# EAGLE design power_indicator_left (EAGLE 7.3.0)
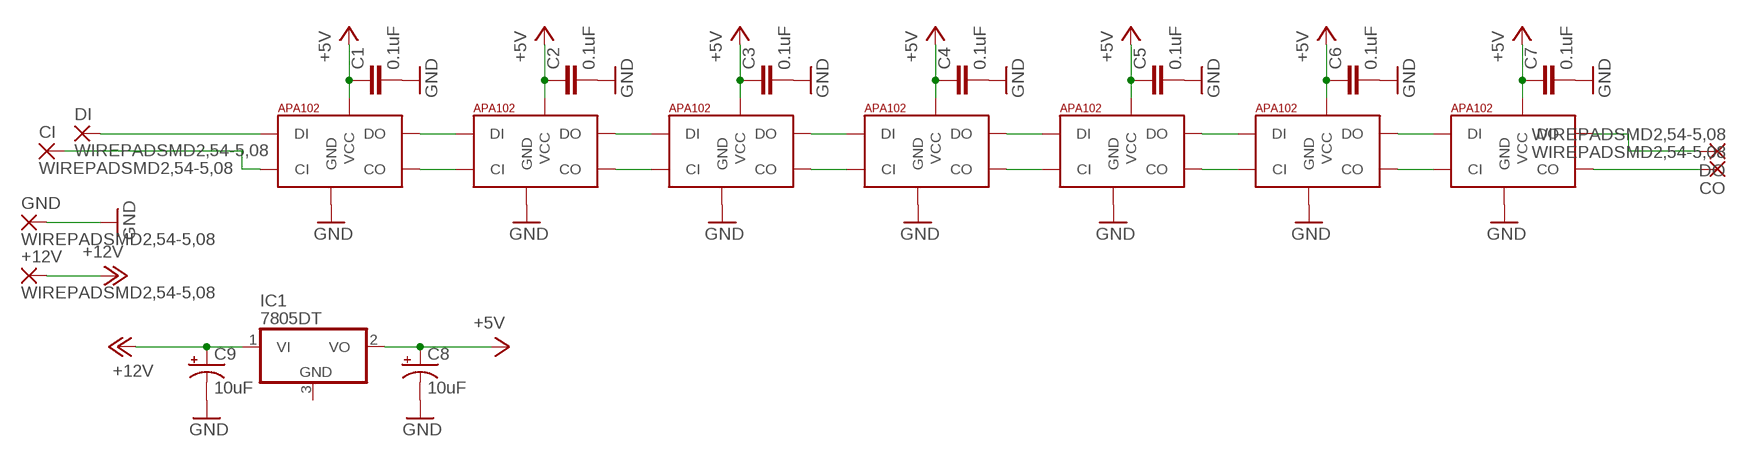
[diagram p0: schematic, sheet 1]

## Parts
+12V  WIREPADSMD2,54-5,08  [SMD2,54-5,08]
C1  0.1uF  0.1UF-100V-10%(0603)  [0603-CAP]
C2  0.1uF  0.1UF-100V-10%(0603)  [0603-CAP]
C3  0.1uF  0.1UF-100V-10%(0603)  [0603-CAP]
C4  0.1uF  0.1UF-100V-10%(0603)  [0603-CAP]
C5  0.1uF  0.1UF-100V-10%(0603)  [0603-CAP]
C6  0.1uF  0.1UF-100V-10%(0603)  [0603-CAP]
C7  0.1uF  0.1UF-100V-10%(0603)  [0603-CAP]
C8  10uF  10UF-TANT  [EIA3216]
C9  10uF  10UF-TANT  [EIA3216]
CI  WIREPADSMD2,54-5,08  [SMD2,54-5,08]
CO  WIREPADSMD2,54-5,08  [SMD2,54-5,08]
DI  WIREPADSMD2,54-5,08  [SMD2,54-5,08]
DO  WIREPADSMD2,54-5,08  [SMD2,54-5,08]
GND  WIREPADSMD2,54-5,08  [SMD2,54-5,08]
IC1  7805DT  [TO252]
U$1  APA1025050  [APA102_5050]
U$2  APA1025050  [APA102_5050]
U$3  APA1025050  [APA102_5050]
U$4  APA1025050  [APA102_5050]
U$5  APA1025050  [APA102_5050]
U$6  APA1025050  [APA102_5050]
U$7  APA1025050  [APA102_5050]

## Nets
+5V: C1.1 C2.1 C3.1 C4.1 C5.1 C6.1 C7.1 C8.A(+) IC1.2(VO) U$1.1(VCC) U$2.1(VCC) U$3.1(VCC) U$4.1(VCC) U$5.1(VCC) U$6.1(VCC) U$7.1(VCC)
+12V: +12V.1(P) C9.A(+) IC1.1(VI)
GND: C1.2 C2.2 C3.2 C4.2 C5.2 C6.2 C7.2 C8.C(-) C9.C(-) GND.1(P) U$1.6(GND) U$2.6(GND) U$3.6(GND) U$4.6(GND) U$5.6(GND) U$6.6(GND) U$7.6(GND)
N$1: U$1.2(CO) U$2.5(CI)
N$2: U$1.3(DO) U$2.4(DI)
N$3: U$2.2(CO) U$3.5(CI)
N$4: U$2.3(DO) U$3.4(DI)
N$5: U$3.2(CO) U$4.5(CI)
N$6: U$3.3(DO) U$4.4(DI)
N$7: U$4.2(CO) U$5.5(CI)
N$8: U$4.3(DO) U$5.4(DI)
N$9: U$5.2(CO) U$6.5(CI)
N$10: U$5.3(DO) U$6.4(DI)
N$11: U$6.2(CO) U$7.5(CI)
N$12: U$6.3(DO) U$7.4(DI)
N$13: CO.1(P) U$7.2(CO)
N$14: DO.1(P) U$7.3(DO)
N$15: DI.1(P) U$1.4(DI)
N$16: CI.1(P) U$1.5(CI)
Unconnected: IC1.3(GND)

## Library data of the parts
+12V CI CO DI DO GND = wirepad:WIREPAD: Wire PAD connect wire on PCB
C1-C7 = SparkFun-Capacitors:0.1UF-100V-10%(0603): CAP-08390; PROD_ID: CAP-08390
C8 C9 = SparkFun-Retired:10UF-TANT: 10uF Tantalum SMT CAP-00811- 16V 10% (EIA-3216); PROD_ID: CAP-00811
IC1 = linear:78*: Positive VOLTAGE REGULATOR Source: http://cache.national.com/ds/LM/LM78L05.pdf http://www.fairchildsemi.com/ds/LM/LM7805.pdf
U$1-U$7 = jos-ph:APA102: APA102C 5050 RGB LED -- Adafruit DotStar Single LED Pixel Product Page: https://www.adafruit.com/products/2343 Datasheet: https://cdn-shop.adafruit.com/product-files/2343/APA102C.pdf

## Board
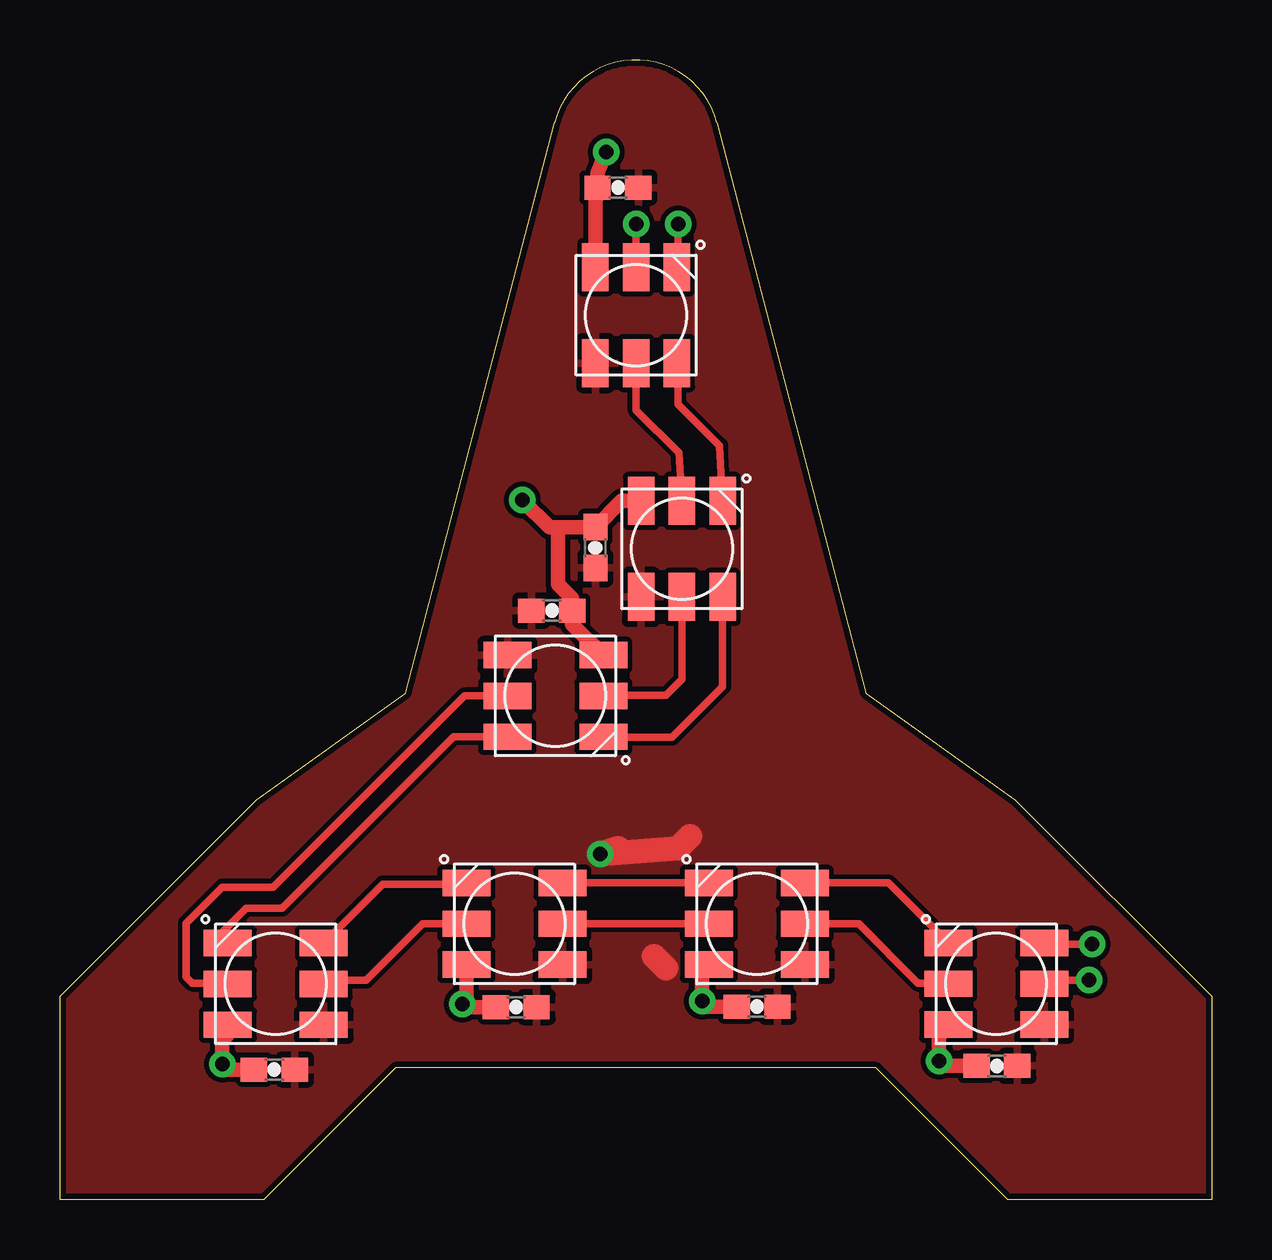
[diagram p1: board, top side]
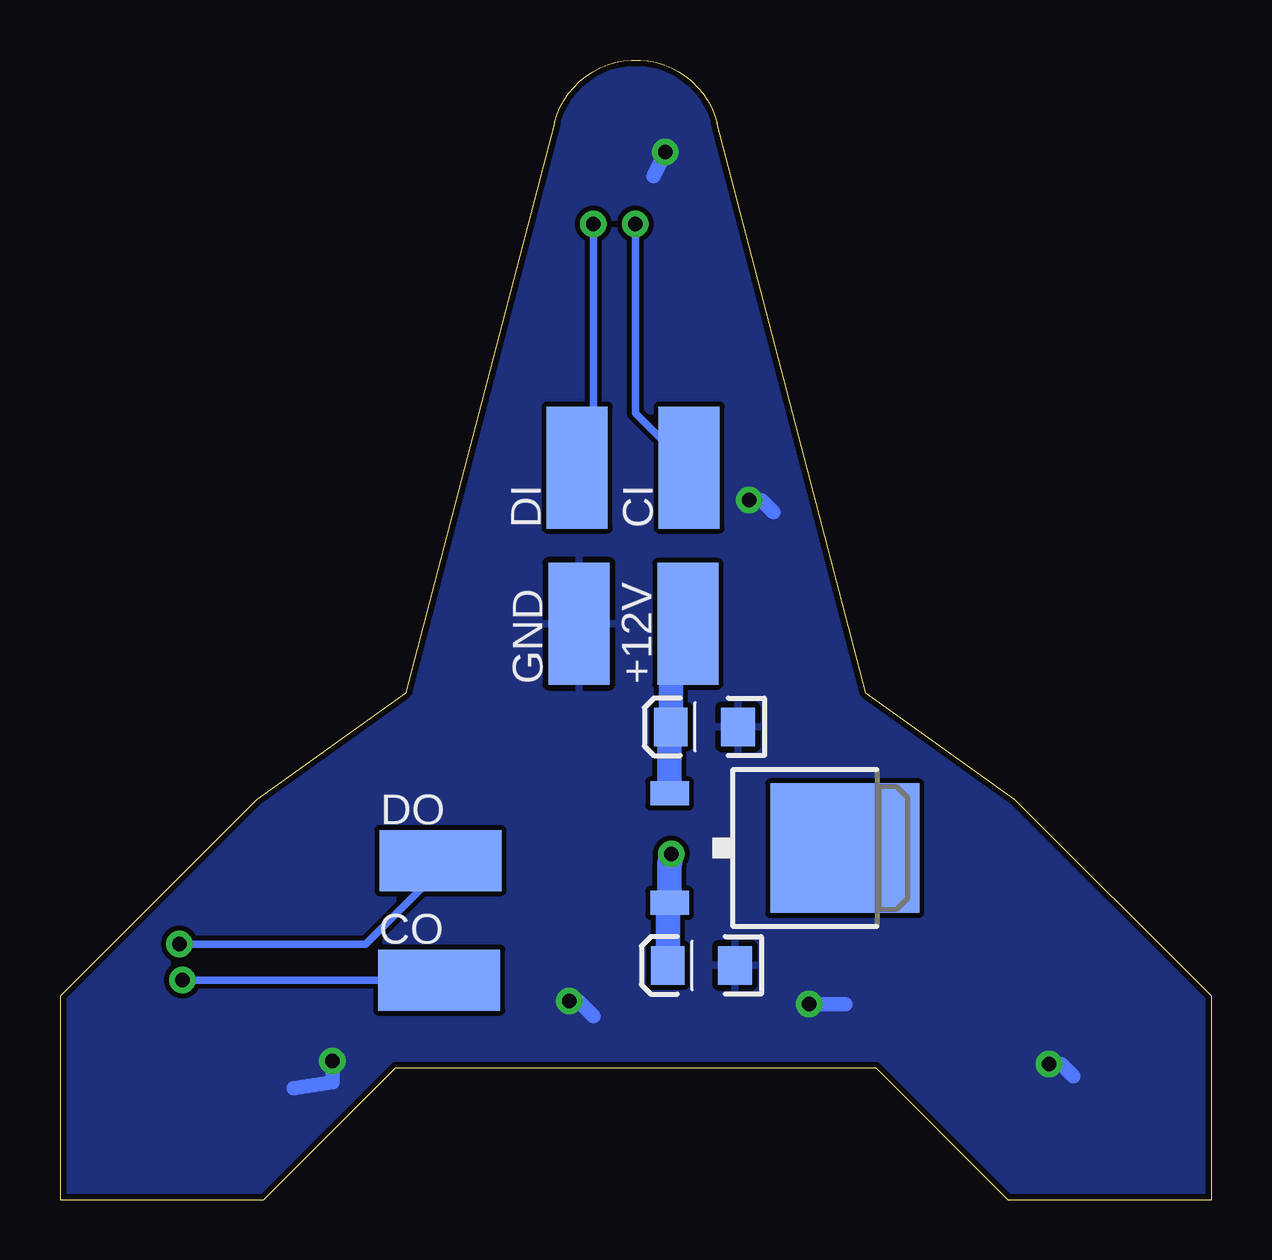
[diagram p2: board, bottom side, seen from below]

Size 48 x 47.5 mm. Coordinates in mm from the lower left corner, seen from the top.
Outline: 34.02,5.5 13.99,5.5 8.49,0 0,0 0,8.48 8.19,16.68 14.4,21.11 20.61,44.88 arc-151 27.39,44.88 33.6,21.11 39.81,16.68 48,8.48 48,0 39.52,0 34.02,5.5
Copper layers (1*16): Top 0.035mm / dielectric 1.5mm / Bottom 0.035mm
Design rules "SparkFun": minimum track width 8mil, minimum drill 20mil, track to track 8mil, track to pad 8mil, pad to pad 8mil, via to via 8mil, smd to smd 8mil, copper to edge 10mil, drill to drill 8mil, minimum pad ring 12mil, minimum via ring 10mil, stop-mask expansion 4mil, vias tented up to drill 25mil, thermal gap 10mil

### Footprints (pad centres in the part's own frame; a part is rotated, then mirrored left to right if it is on the bottom)
SMD2,54-5,08 = smd 2.54 x 5.08: 1 0,0
0603-CAP = smd 1.1 x 1: 1 -0.85,0; 2 0.85,0
EIA3216 = smd 1.4 x 1.6: A 1.4,0; C -1.4,0
TO252 = smd 1 x 1.6: 1 -2.28,-4.8; 2 2.28,-4.8 | smd 5.4 x 6.2: 3 0,2.5
APA102_5050 = smd 2 x 1.1: 1 2,-1.7; 2 2,0; 3 2,1.7; 4 -2,1.7; 5 -2,0; 6 -2,-1.7

### Placement (x,y rotation side)
+12V  21.83,24 0 bottom
C1  23.26,42.18 180 top
C2  22.32,27.18 90 top
C3  20.5,24.55 0 top
C4  8.94,5.43 180 top
C5  19.02,8.04 180 top
C6  29.06,8.05 180 top
C7  39.05,5.58 180 top
C8  21.27,9.77 180 bottom
C9  21.14,19.71 180 bottom
CI  21.78,30.51 0 bottom
CO  32.2,9.16 270 bottom
DI  26.45,30.51 0 bottom
DO  32.14,14.13 270 bottom
GND  26.37,24 0 bottom
IC1  17.79,14.66 270 bottom
U$1  24.02,36.86 270 top
U$2  25.92,27.12 270 top
U$3  20.65,21 180 top
U$4  9,9 0 top
U$5  18.95,11.51 0 top
U$6  29.05,11.51 0 top
U$7  39.02,9.01 0 top

### Tracks (layer width: path | path; a pad name or v marks a point on that pad's centre or on a via)
+5V  (via drill 0.6)
  Top 1.016: 24.77,10.16 25.27,9.66 | 26.27,15.16 25.77,14.66 v22.52,14.41 23.27,14.66
  Bottom 1.016: C8.A 22.67,12.3 IC1.2 22.59,13.98 v22.52,14.41
  pour Top: -1.23,48.66 -1.23,-3.34 49.77,-3.34 49.77,48.66
+12V
  Bottom 1.016: IC1.1 22.59,19.66 C9.A 22.54,23.29 +12V.1
GND  (via drill 0.6)
  Top 0.61: C6.2 27,8.05 v26.77,8.29 26.77,9.66 26.91,9.8 U$6.6 | C7.2 36.6,5.58 v36.64,5.79 36.64,6.8 U$7.6 | U$1.6 22.32,41.59 C1.2 22.41,42.8 v22.77,43.66 | C4.2 7,5.43 v6.77,5.66 6.77,6.66 7,6.89 U$4.6 | C5.2 16.89,8.04 v16.77,8.16 16.95,8.34 U$5.6 | U$3.6 21.35,24 C3.2 21.35,25.07 20.77,25.66 20.77,28.03 | U$2.6 23.41,29.12 C2.2 20.77,28.03 | 20.77,28.03 20.4,28.03 v19.27,29.16
  Bottom 0.61: v26.77,8.29 26.39,8.29 25.77,7.66 | v36.64,5.79 36.64,4.91 38.27,4.66 | v22.77,43.66 23.27,42.66 | v6.77,5.66 6.27,5.66 5.77,5.16 | v16.77,8.16 15.27,8.16 | v19.27,29.16 18.77,29.16 18.27,28.66
  pour Bottom: -1.23,48.66 -1.23,-3.34 49.77,-3.34 49.77,48.66
N$1
  Top 0.305: U$2.5 25.8,31.13 24.02,32.91 U$1.2
N$2
  Top 0.305: U$2.4 27.5,31.43 25.77,33.16 25.77,34.81 U$1.3
N$3
  Top 0.305: U$3.5 22.56,21.04 25.27,21.04 25.92,21.69 U$2.2
N$4
  Top 0.305: U$3.4 22.54,19.29 25.52,19.29 27.62,21.39 U$2.3
N$5
  Top 0.305: U$3.2 16.86,21 8.89,13.04 6.77,13.04 5.27,11.54 5.27,9.29 5.52,9.04 6.96,9.04 U$4.5
N$6
  Top 0.305: 7.04,10.66 U$4.4 6.77,10.93 6.77,11.16 7.77,12.16 9.27,12.16 16.41,19.3 U$3.3
N$7
  Top 0.305: U$5.5 15.11,11.51 12.77,9.16 11.16,9.16 U$4.2
N$8
  Top 0.305: U$5.4 16.9,13.16 13.46,13.16 U$4.3
N$9
  Top 0.305: U$6.5 U$5.2
N$10
  Top 0.305: U$5.3 U$6.4
N$11
  Top 0.305: U$6.2 33.3,11.51 35.77,9.04 36.99,9.04 U$7.5
N$12
  Top 0.305: U$6.3 34.52,13.21 U$7.4
N$13  (via drill 0.6)
  Top 0.305: v42.89,9.16 41.18,9.16 U$7.2
  Bottom 0.305: CO.1 v42.89,9.16
N$14  (via drill 0.6)
  Top 0.305: v43.02,10.66 41.07,10.66 U$7.3
  Bottom 0.305: DO.1 32.14,13.79 35.27,10.66 v43.02,10.66
N$15  (via drill 0.6)
  Top 0.305: v25.77,40.66 25.77,38.91 U$1.4
  Bottom 0.305: v25.77,40.66 25.77,30.66 26.77,29.66 26.77,30.19 DI.1
N$16  (via drill 0.6)
  Top 0.305: U$1.5 v24.02,40.66
  Bottom 0.305: CI.1 21.78,30.55 24.02,32.78 v24.02,40.66